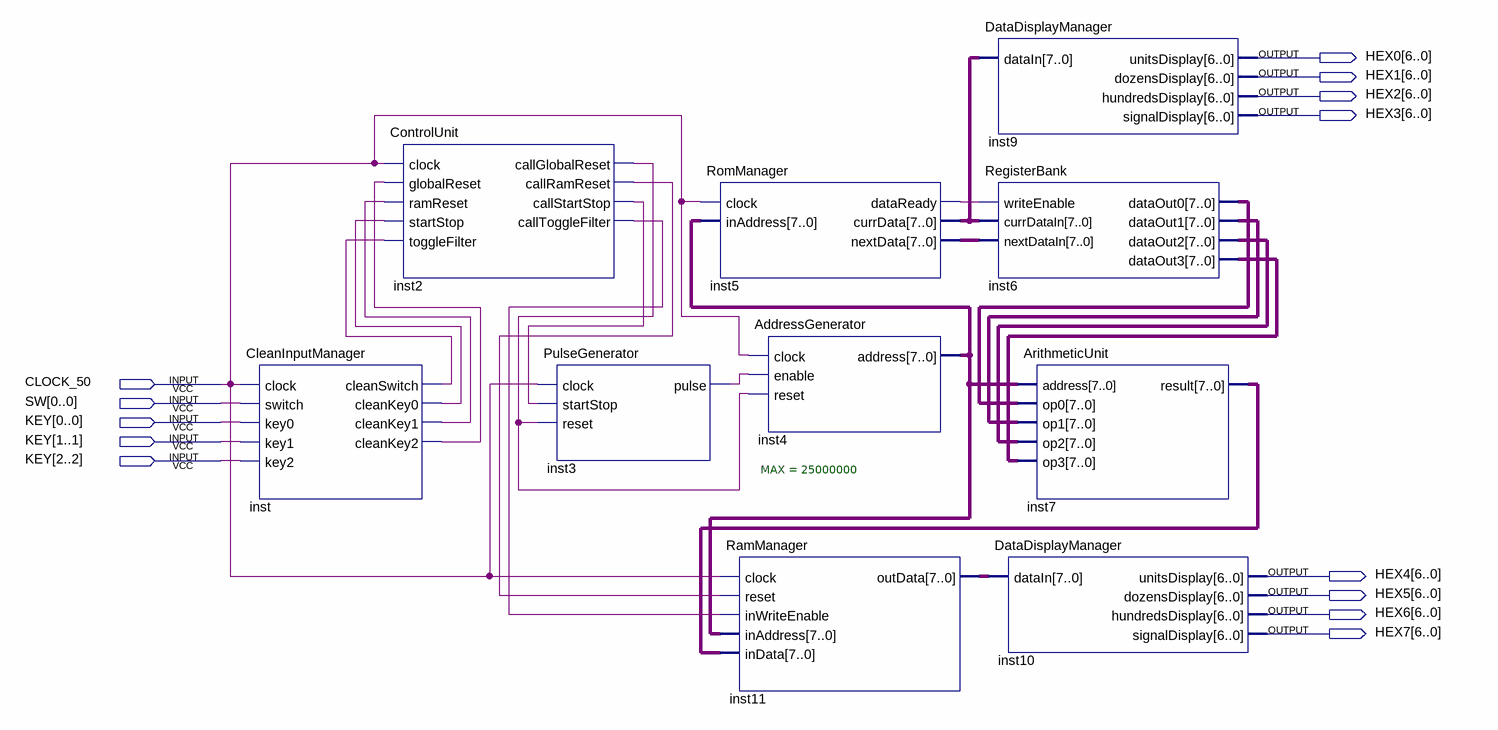
[diagram p0: schematic sheet]
// Quartus schematic SimplifiedSchematic.bdf as structural Verilog: 10 symbols, 13 pins
module SimplifiedSchematic (
  input  CLOCK_50,
  input  [0:0] SW,
  input  [2:0] KEY,
  output [6:0] HEX0,
  output [6:0] HEX1,
  output [6:0] HEX2,
  output [6:0] HEX3,
  output [6:0] HEX4,
  output [6:0] HEX5,
  output [6:0] HEX6,
  output [6:0] HEX7
);

  wire inst2_callglobalreset, inst2_callramreset, inst2_callstartstop, inst2_calltogglefilter, inst3_pulse,
       inst5_dataready, inst_cleankey0, inst_cleankey1, inst_cleankey2, inst_cleanswitch;
  wire [7:0] inst4_address, inst5_currdata, inst5_nextdata, inst6_dataout0, inst6_dataout1, inst6_dataout2,
       inst6_dataout3, inst7_result, inst11_outdata;

  CleanInputManager inst (
    .clock(CLOCK_50), .switch(SW[0]), .key0(KEY[0]), .key1(KEY[1]), .key2(KEY[2]),
    .cleanSwitch(inst_cleanswitch), .cleanKey0(inst_cleankey0), .cleanKey1(inst_cleankey1),
    .cleanKey2(inst_cleankey2));
  ControlUnit inst2 (
    .clock(CLOCK_50), .globalReset(inst_cleankey2), .ramReset(inst_cleankey1), .startStop(inst_cleankey0),
    .toggleFilter(inst_cleanswitch), .callGlobalReset(inst2_callglobalreset),
    .callRamReset(inst2_callramreset), .callStartStop(inst2_callstartstop),
    .callToggleFilter(inst2_calltogglefilter));
  PulseGenerator #(.MAX(25000000)) inst3 (
    .clock(CLOCK_50), .startStop(inst2_callstartstop), .reset(inst2_callglobalreset), .pulse(inst3_pulse));
  RomManager inst5 (
    .clock(CLOCK_50), .inAddress(inst4_address), .dataReady(inst5_dataready), .currData(inst5_currdata),
    .nextData(inst5_nextdata));
  AddressGenerator inst4 (
    .clock(CLOCK_50), .enable(inst3_pulse), .reset(inst2_callglobalreset), .address(inst4_address));
  RamManager inst11 (
    .clock(CLOCK_50), .reset(inst2_callramreset), .inWriteEnable(inst2_calltogglefilter),
    .inAddress(inst4_address), .inData(inst7_result), .outData(inst11_outdata));
  DataDisplayManager inst9 (
    .dataIn(inst5_currdata), .unitsDisplay(HEX0), .dozensDisplay(HEX1), .hundredsDisplay(HEX2),
    .signalDisplay(HEX3));
  RegisterBank inst6 (
    .writeEnable(inst5_dataready), .currDataIn(inst5_currdata), .nextDataIn(inst5_nextdata),
    .dataOut0(inst6_dataout0), .dataOut1(inst6_dataout1), .dataOut2(inst6_dataout2), .dataOut3(inst6_dataout3));
  ArithmeticUnit inst7 (
    .address(inst4_address), .op0(inst6_dataout0), .op1(inst6_dataout1), .op2(inst6_dataout2),
    .op3(inst6_dataout3), .result(inst7_result));
  DataDisplayManager inst10 (
    .dataIn(inst11_outdata), .unitsDisplay(HEX4), .dozensDisplay(HEX5), .hundredsDisplay(HEX6),
    .signalDisplay(HEX7));
endmodule
